# EAGLE design v1 (EAGLE 7.2.0)
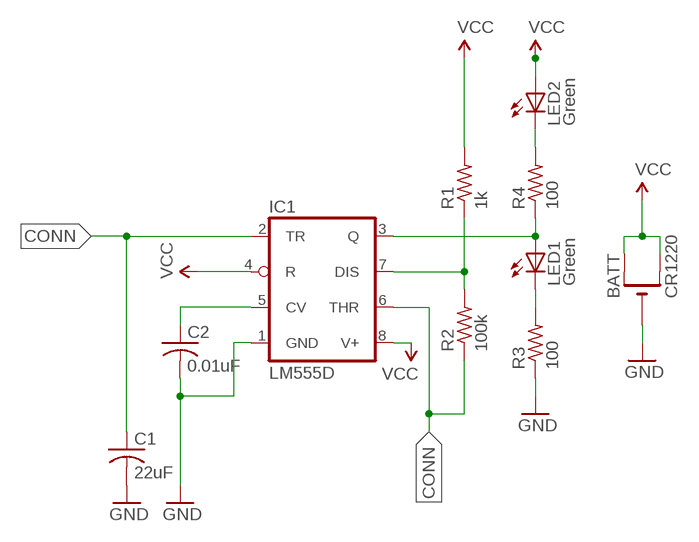
[diagram p0: schematic, sheet 1]

## Parts
BATT  CR1220  CR1220SMT  [CR1220-SMD]
C1  22uF  C-USC0805  [C0805]
C2  0.01uF  C-USC0805  [C0805]
IC1  LM555D  [SO08]
LED1  Green  LEDCHIPLED_0805  [CHIPLED_0805]
LED2  Green  LEDCHIPLED_0805  [CHIPLED_0805]
R1  1k  R-US_R0805  [R0805]
R2  100k  R-US_R0805  [R0805]
R3  100  R-US_R0805  [R0805]
R4  100  R-US_R0805  [R0805]

## Nets
CONN: C1.1 IC1.2(TR) IC1.6(THR) R2.1
GND: BATT.- C1.2 R3.1
N$1: LED2.C R4.2
N$2: IC1.3(Q) LED1.A R4.1
N$3: LED1.C R3.2
N$4: IC1.7(DIS) R1.1 R2.2
N$10: C2.1 IC1.5(CV)
N$11: C2.2 IC1.1(GND)
VCC: BATT.+$1(+) BATT.+$2(+1) IC1.4(R) IC1.8(V+) LED2.A R1.2

## Library data of the parts
BATT = adafruit:CR1220: CR1216/CR1220/CR1225 12mm 3V lithium coin cell Great for battery packup. Both SMT and THM holders. Note the THM package has the ground pads on both sides of the PCB so that the masks are the same - this reduces the cost; OC_NEWARK: unknown
C1 = adafruit:C-US: CAPACITOR, American symbol; MF: KEMET; MPN: C0805C224K4RACTU; OC_NEWARK: 01H7272
C2 = adafruit:C-US: CAPACITOR, American symbol; MF: AVX CORPORATION; MPN: 08051C103KAT2A; OC_NEWARK: 01H7150
IC1 = adafruit:*555: TIMER Changed DIP package to have round (not oval) pin pads http://www.ladyada.net/library/pcb/eaglelibrary.html; MPN: LM555CM; OC_NEWARK: 97K3556
LED1 LED2 = adafruit:LED: LED OSRAM: - CHIPLED LG R971, LG N971, LY N971, LG Q971, LY Q971, LO R971, LY R971 LH N974, LH R974 LS Q976, LO Q976, LY Q976 LO Q996 - Hyper CHIPLED LW Q18S LB Q993, LB Q99A, LB R99A - SideLED LS A670, LO A670, LY A670, LG A670, LP A670 LB A673, LV A673, LT A673, LW A673 LH A674 LY A675 LS A676, LA A676, LO A676, LY A676, LW A676 LS A679, LY A679, LG A679 - Hyper Micro SIDELED® LS Y876, LA Y876, LO Y876, LY Y876 LT Y87S - SmartLED LW L88C, LW L88S LB L89C, LB L89S, LG L890 LS L89K, LO L89K, LY L89K LS L896, LA L896, LO L896, LY L896 - TOPLED LS T670, LO T670, LY T670, LG T670, LP T670 LSG T670, LSP T670, LSY T670, LOP T670, LYG T670 LG T671, LOG T671, LSG T671 LB T673, LV T673, LT T673, LW T673 LH T674 LS T676, LA T676, LO T676, LY T676, LB T676, LH T676, LSB T676, LW T676 LB T67C, LV T67C, LT T67C, LS T67K, LO T67K, LY T67K, LW E67C LS E67B, LA E67B, LO E67B, LY E67B, LB E67C, LV E67C, LT E67C LW T67C LS T679, LY T679, LG T679 LS T770, LO T770, LY T770, LG T770, LP T770 LB T773, LV T773, LT T773, LW T773 LH T774 LS E675, LA E675, LY E675, LS T675 LS T776, LA T776, LO T776, LY T776, LB T776 LHGB T686 LT T68C, LB T68C - Hyper Mini TOPLED® LB M676 - Mini TOPLED Santana® LG M470 LS M47K, LO M47K, LY M47K Source: http://www.osram.convergy.de/; MPN: 5988160107F.; OC_NEWARK: 59M5867
R1 R3 R4 = adafruit:R-US_: RESISTOR, American symbol; MF: VISHAY/DALE; MPN: CRCW08051K00FKTA; OC_NEWARK: 05F1507
R2 = adafruit:R-US_: RESISTOR, American symbol; MPN: MCHV05WAJ0104T5E; OC_NEWARK: 01N7279

## Net classes
0 default: width 0.305 mm, drill 0.508 mm, clearance 0.254 mm

## Board
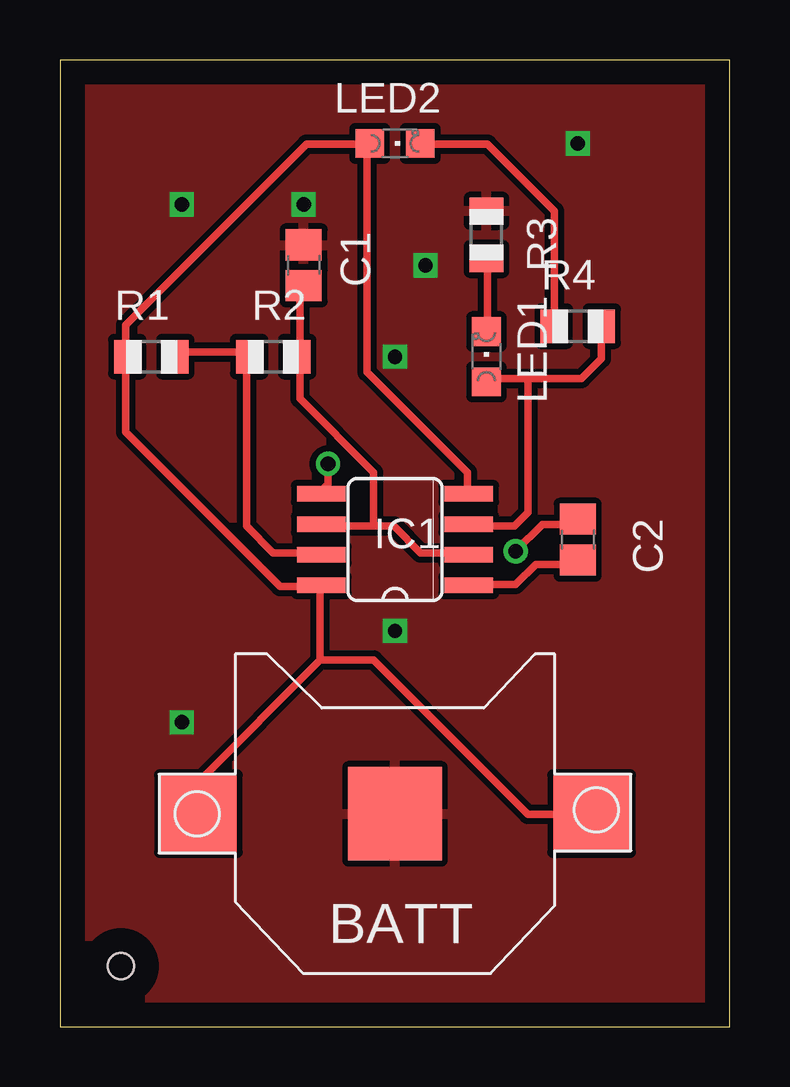
[diagram p1: board, top side]
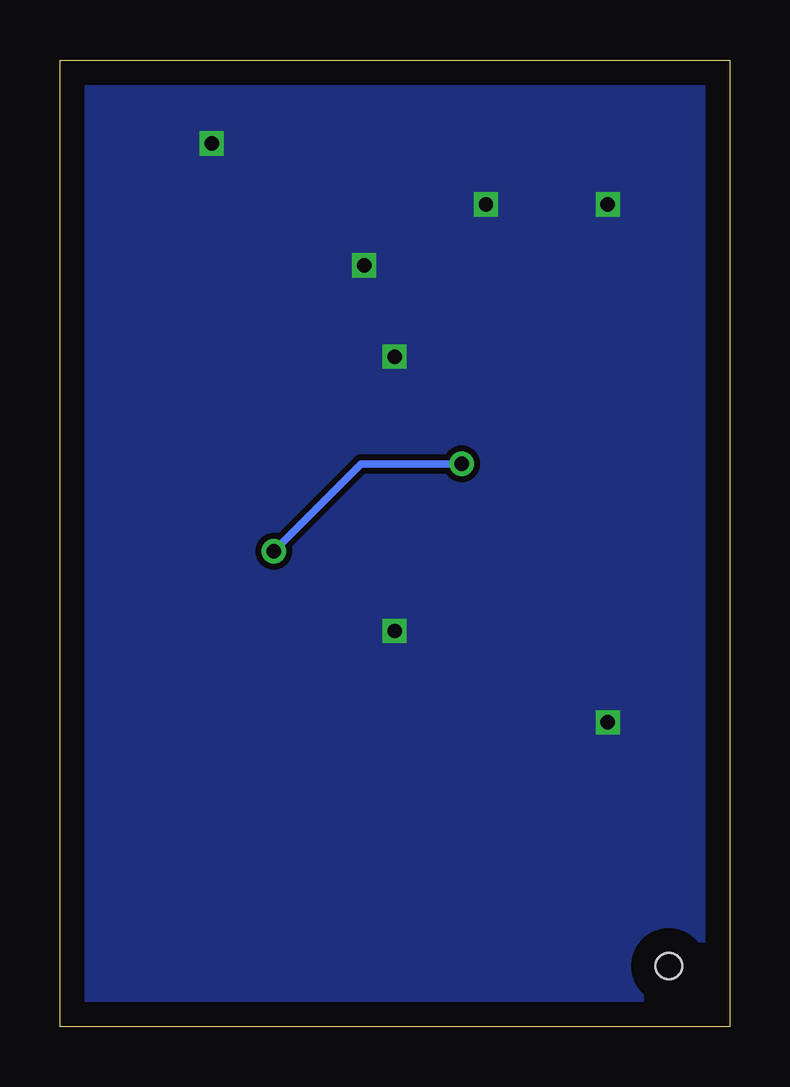
[diagram p2: board, bottom side, seen from below]

Size 27.92 x 40.31 mm. Coordinates in mm from the lower left corner, seen from the top.
Outline: 0,0 27.92,0 27.92,40.31 0,40.31 0,0
Copper layers (1*16): Top 0.035mm / dielectric 1.5mm / Bottom 0.035mm
Design rules "default *": minimum track width 10mil, minimum drill 20mil, track to track 8mil, track to pad 8mil, pad to pad 8mil, via to via 8mil, smd to smd 8mil, copper to edge 40mil, drill to drill 8mil, minimum pad ring 10mil, minimum via ring 8mil, stop-mask expansion 4mil, vias tented up to drill 0mil, thermal gap 10mil
Holes 1.1 mm at 2.54,2.54

### Footprints (pad centres in the part's own frame; a part is rotated, then mirrored left to right if it is on the bottom)
CR1220-SMD = smd 3.2 x 3.2: +$1 -8.2,0; +$2 8.2,0 | smd 3.9 x 3.9: - 0,0
C0805 = smd 1.3 x 1.5: 1 -0.85,0; 2 0.85,0
SO08 = smd 0.66 x 2.032: 1 -1.905,-3.073; 2 -0.635,-3.073; 3 0.635,-3.073; 4 1.905,-3.073; 5 1.905,3.073; 6 0.635,3.073; 7 -0.635,3.073; 8 -1.905,3.073
CHIPLED_0805 = smd 1.2 x 1.2: A 0,-1.05; C 0,1.05
R0805 = smd 1.1 x 1.4: 1 -1,0; 2 1,0

### Placement (x,y rotation side)
BATT  13.97,8.89 0 top
C1  10.16,31.75 90 top
C2  21.59,20.32 270 top
IC1  13.97,20.32 90 top
LED1  17.78,27.94 0 top
LED2  13.97,36.83 270 top
R1  3.81,27.94 180 top
R2  8.89,27.94 180 top
R3  17.78,33.02 270 top
R4  21.59,29.21 180 top

### Tracks (layer width: path | path; a pad name or v marks a point on that pad's centre or on a via)
CONN
  Top 0.305: C1.1 10.01,30.66 10.01,28.14 R2.1 10.01,27.86 10.01,26.19 13.08,23.11 13.08,20.88 | 13.08,20.88 13.92,20.88 15.04,19.76 16.99,19.76 IC1.2 | 13.08,20.88 11.12,20.88 IC1.6
GND  (via drill 0.6)
  other vias: 5.08,12.7 5.08,34.29 15.24,31.75 13.97,27.94 21.59,36.83 13.97,16.51 10.16,34.29
  pour Top: -2.54,43.18 -2.54,-2.54 30.48,-2.54 30.48,43.18
  pour Bottom: 29.21,41.91 -1.27,41.91 -1.27,-1.27 29.21,-1.27
N$1
  Top 0.305: LED2.C 15.04,36.8 17.83,36.8 20.62,34.01 20.62,29.26 R4.2
N$2
  Top 0.305: 19.51,27.03 21.74,27.03 22.58,27.86 22.58,28.98 R4.1 | 19.51,27.03 17.83,27.03 LED1.A | 19.51,27.03 19.51,21.44 18.95,20.88 17.27,20.88 IC1.3
N$3
  Top 0.305: LED1.C 17.83,29.26 17.83,31.77 R3.2
N$4
  Top 0.305: R1.1 4.98,28.14 7.77,28.14 R2.2 7.77,27.86 7.77,20.88 8.89,19.76 10.85,19.76 IC1.7
N$10  (via drill 0.61)
  Top 0.305: v19,19.84 20.12,20.95 21.51,20.95 C2.1 | v11.18,23.47 11.18,22.63 10.9,22.35 IC1.5
  Bottom 0.305: v19,19.84 15.37,23.47 v11.18,23.47
N$11
  Top 0.305: C2.2 21.51,19.28 19.84,19.28 19,18.44 17.04,18.44 IC1.1
VCC
  Top 0.305: 12.8,36.8 10.29,36.8 2.74,29.26 2.74,28.14 R1.2 2.74,27.86 2.74,24.79 9.17,18.36 10.85,18.36 | 12.8,36.8 12.8,27.3 16.99,23.11 16.99,22.28 IC1.4 | 12.8,36.8 LED2.A | 10.85,15.29 10.85,18.36 | 10.85,15.29 5.82,10.26 5.82,9.14 BATT.+$1 | 10.85,15.29 13.08,15.29 19.51,8.87 22.02,8.87 BATT.+$2 | 10.85,18.36 IC1.8